# Altium schematic sheet 01 INPUT_PWR.SchDoc
size 420 x 297 mm; Address1: Address1; Address2: Address2; Address3: Address3; Address4: Address4; DocumentNumber: АБВГ.123456.001 Э3; SheetNumber: 1; SheetTotal: 23; Scale: 1:1; DocumentType: Схема электрическая принципиальная; FirstReferrence: АБВГ.123456.001
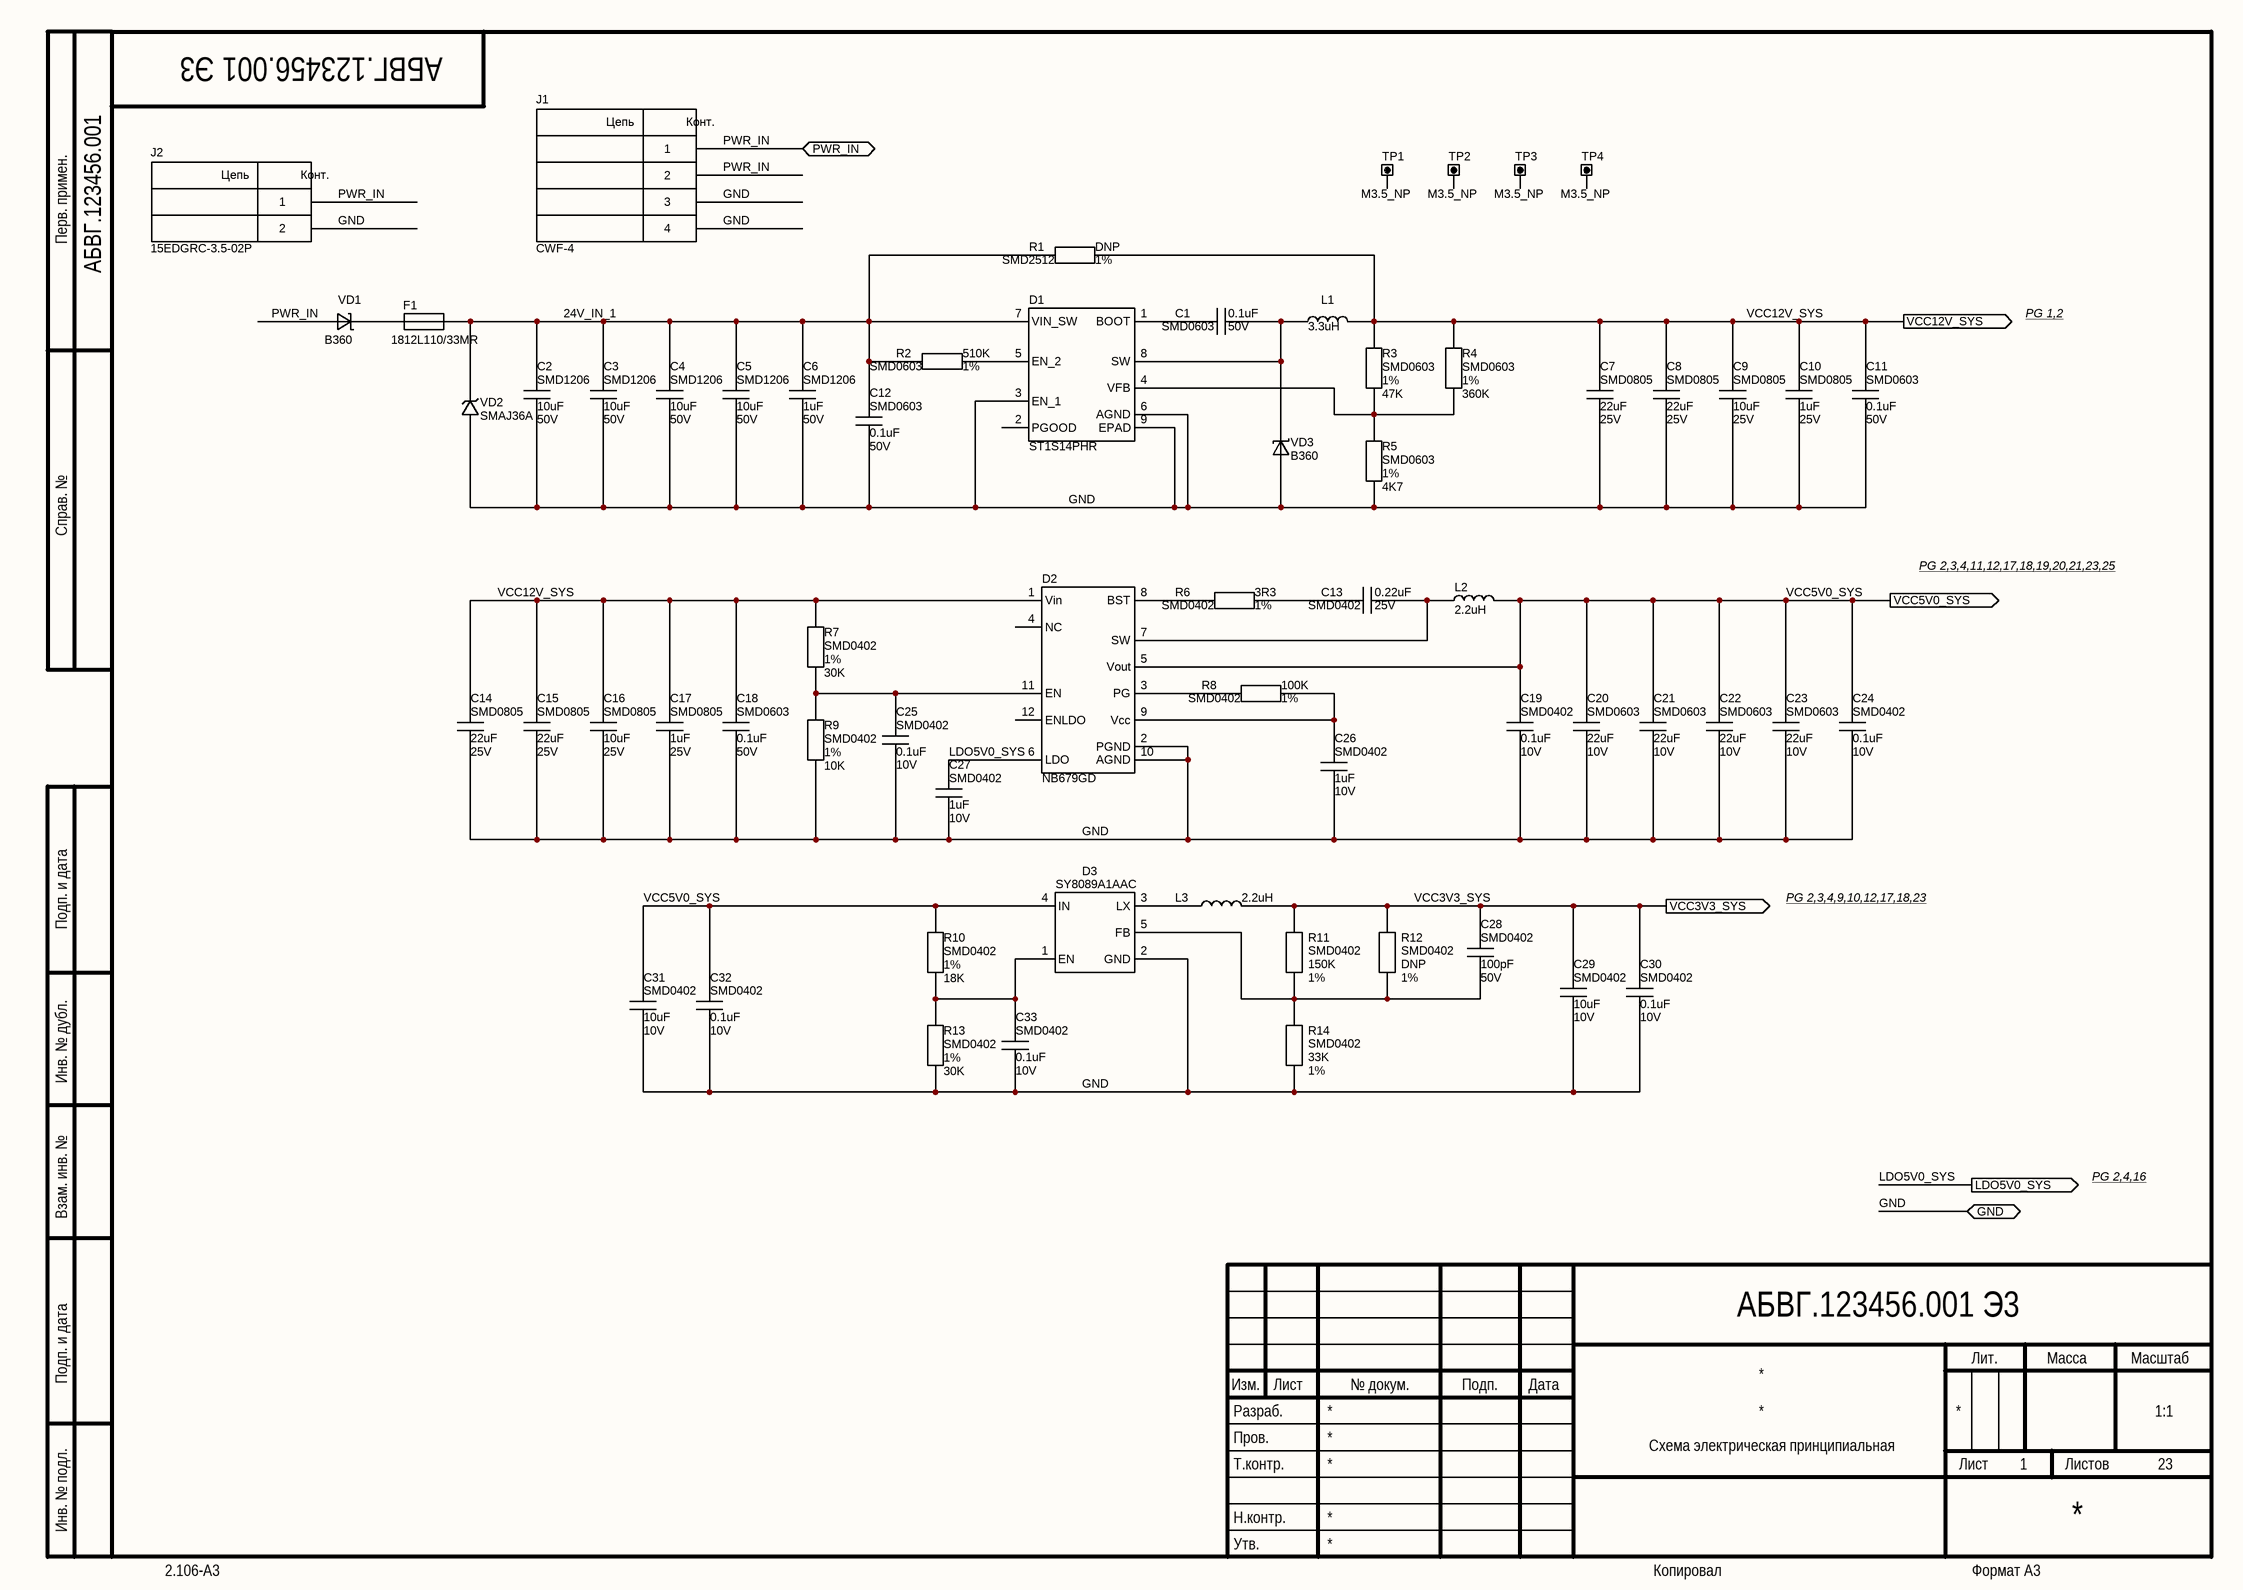
[diagram p0: 01 INPUT_PWR.SchDoc]

## Parts
C1  Package: SMD0603  Voltage: 50V  [CAP_SMD_0603]  (hidden comment: 0.1uF)
C2  Package: SMD1206  Voltage: 50V  [CAP_SMD_1206]  (hidden comment: 10uF)
C3  Package: SMD1206  Voltage: 50V  [CAP_SMD_1206]  (hidden comment: 10uF)
C4  Package: SMD1206  Voltage: 50V  [CAP_SMD_1206]  (hidden comment: 10uF)
C5  Package: SMD1206  Voltage: 50V  [CAP_SMD_1206]  (hidden comment: 10uF)
C6  Package: SMD1206  Voltage: 50V  [CAP_SMD_1206]  (hidden comment: 1uF)
C7  Package: SMD0805  Voltage: 25V  [CAP_SMD_0805]  (hidden comment: 22uF)
C8  Package: SMD0805  Voltage: 25V  [CAP_SMD_0805]  (hidden comment: 22uF)
C9  Package: SMD0805  Voltage: 25V  [CAP_SMD_0805]  (hidden comment: 10uF)
C10  Package: SMD0805  Voltage: 25V  [CAP_SMD_0805]  (hidden comment: 1uF)
C11  Package: SMD0603  Voltage: 50V  [CAP_SMD_0603]  (hidden comment: 0.1uF)
C12  Package: SMD0603  Voltage: 50V  [CAP_SMD_0603]  (hidden comment: 0.1uF)
C13  Package: SMD0402  Voltage: 25V  [CAP_SMD_0402]  (hidden comment: 0.22uF)
C14  Package: SMD0805  Voltage: 25V  [CAP_SMD_0805]  (hidden comment: 22uF)
C15  Package: SMD0805  Voltage: 25V  [CAP_SMD_0805]  (hidden comment: 22uF)
C16  Package: SMD0805  Voltage: 25V  [CAP_SMD_0805]  (hidden comment: 10uF)
C17  Package: SMD0805  Voltage: 25V  [CAP_SMD_0805]  (hidden comment: 1uF)
C18  Package: SMD0603  Voltage: 50V  [CAP_SMD_0603]  (hidden comment: 0.1uF)
C19  Package: SMD0402  Voltage: 10V  [CAP_SMD_0402]  (hidden comment: 0.1uF)
C20  Package: SMD0603  Voltage: 10V  [CAP_SMD_0603]  (hidden comment: 22uF)
C21  Package: SMD0603  Voltage: 10V  [CAP_SMD_0603]  (hidden comment: 22uF)
C22  Package: SMD0603  Voltage: 10V  [CAP_SMD_0603]  (hidden comment: 22uF)
C23  Package: SMD0603  Voltage: 10V  [CAP_SMD_0603]  (hidden comment: 22uF)
C24  Package: SMD0402  Voltage: 10V  [CAP_SMD_0402]  (hidden comment: 0.1uF)
C25  Package: SMD0402  Voltage: 10V  [CAP_SMD_0402]  (hidden comment: 0.1uF)
C26  Package: SMD0402  Voltage: 10V  [CAP_SMD_0402]  (hidden comment: 1uF)
C27  Package: SMD0402  Voltage: 10V  [CAP_SMD_0402]  (hidden comment: 1uF)
C28  Package: SMD0402  Voltage: 50V  [CAP_SMD_0402]  (hidden comment: 100pF)
C29  Package: SMD0402  Voltage: 10V  [CAP_SMD_0402]  (hidden comment: 10uF)
C30  Package: SMD0402  Voltage: 10V  [CAP_SMD_0402]  (hidden comment: 0.1uF)
C31  Package: SMD0402  Voltage: 10V  [CAP_SMD_0402]  (hidden comment: 10uF)
C32  Package: SMD0402  Voltage: 10V  [CAP_SMD_0402]  (hidden comment: 0.1uF)
C33  Package: SMD0402  Voltage: 10V  [CAP_SMD_0402]  (hidden comment: 0.1uF)
D1  ST1S14PHR  [SO8_PWR]
D2  NB679GD  [QFN-12_2mmx3mm]
D3  SY8089A1AAC  [SOT23-5]
F1  value 1812L110/33MR  [FUSE_SMD_1812]  (hidden comment: Value)
J1  CWF-4  [CWF-4]
J2  15EDGRC-3.5-02P  [15EDGRC-3.5-02P]
L1  value 3.3uH  [IHLP2020]  (hidden comment: Value)
L2  value 2.2uH  [IHLP2020]  (hidden comment: Value)
L3  value 2.2uH  [HEI252012A]  (hidden comment: Value)
R1  Package: SMD2512  Tolerance: 1%  [RES_SMD_2512]  (hidden comment: DNP)
R2  Package: SMD0603  Tolerance: 1%  [RES_SMD_0603]  (hidden comment: 510K)
R3  Package: SMD0603  Tolerance: 1%  [RES_SMD_0603]  (hidden comment: 47K)
R4  Package: SMD0603  Tolerance: 1%  [RES_SMD_0603]  (hidden comment: 360K)
R5  Package: SMD0603  Tolerance: 1%  [RES_SMD_0603]  (hidden comment: 4K7)
R6  Package: SMD0402  Tolerance: 1%  [RES_SMD_0402]  (hidden comment: 3R3)
R7  Package: SMD0402  Tolerance: 1%  [RES_SMD_0402]  (hidden comment: 30K)
R8  Package: SMD0402  Tolerance: 1%  [RES_SMD_0402]  (hidden comment: 100K)
R9  Package: SMD0402  Tolerance: 1%  [RES_SMD_0402]  (hidden comment: 10K)
R10  Package: SMD0402  Tolerance: 1%  [RES_SMD_0402]  (hidden comment: 18K)
R11  Package: SMD0402  Tolerance: 1%  [RES_SMD_0402]  (hidden comment: 150K)
R12  Package: SMD0402  Tolerance: 1%  [RES_SMD_0402]  (hidden comment: DNP)
R13  Package: SMD0402  Tolerance: 1%  [RES_SMD_0402]  (hidden comment: 30K)
R14  Package: SMD0402  Tolerance: 1%  [RES_SMD_0402]  (hidden comment: 33K)
TP1  M3.5_NP  [M3.5_NP]
TP2  M3.5_NP  [M3.5_NP]
TP3  M3.5_NP  [M3.5_NP]
TP4  M3.5_NP  [M3.5_NP]
VD1  value B360  [SMA]  (hidden comment: Value)
VD2  SMAJ36A  [SMA]
VD3  value B360  [SMA]  (hidden comment: Value)

## Ports
GND (bidir), LDO5V0_SYS (out), PWR_IN (bidir), VCC3V3_SYS (out), VCC5V0_SYS (out), VCC12V_SYS (out)

## Nets
24V_IN_1: C2.2 C3.2 C4.2 C5.2 C6.2 C12.2 D1.7(VIN_SW) F1.2 R1.1 R2.1 VD2.2(C)
GND: C2.1 C3.1 C4.1 C5.1 C6.1 C7.1 C8.1 C9.1 C10.1 C11.1 C12.1 C14.1 C15.1 C16.1 C17.1 C18.1 C19.2 C20.1 C21.1 C22.1 C23.1 C24.2 C25.2 C26.2 C27.2 C29.2 C30.2 C31.2 C32.2 C33.2 D1.3(EN_1) D1.6(AGND) D1.9(EPAD) D2.2(PGND) D2.10(AGND) D3.2(GND) J1.3 J1.4 J2.2 R5.1 R9.1 R13.1 R14.1 VD2.1(A) VD3.1(A) ; port GND
LDO5V0_SYS: C27.1 D2.6(LDO) ; port LDO5V0_SYS
PWR_IN: J1.1 J1.2 J2.1 VD1.1(A) ; port PWR_IN
VCC3V3_SYS: C28.1 C29.1 C30.1 L3.1 R11.2 R12.2 ; port VCC3V3_SYS
VCC5V0_SYS: C19.1 C20.2 C21.2 C22.2 C23.2 C24.1 C31.1 C32.1 D2.5(Vout) D3.4(IN) L2.1 R10.2 ; port VCC5V0_SYS
VCC12V_SYS: C7.2 C8.2 C9.2 C10.2 C11.2 C14.2 C15.2 C16.2 C17.2 C18.2 D2.1(Vin) L1.1 R1.2 R3.2 R4.2 R7.2 ; port VCC12V_SYS
NetC1_1: C1.1 D1.8(SW) L1.2 VD3.2(C)
NetC1_2: C1.2 D1.1(BOOT)
NetC13_1: C13.1 D2.7(SW) L2.2
NetC13_2: C13.2 R6.2
NetC25_1: C25.1 D2.11(EN) R7.1 R9.2
NetC26_1: C26.1 D2.9(Vcc) R8.1
NetC28_2: C28.2 D3.5(FB) R11.1 R12.1 R14.2
NetC33_1: C33.1 D3.1(EN) R10.1 R13.2
NetD1_4: D1.4(VFB) R3.1 R4.1 R5.2
NetD1_5: D1.5(EN_2) R2.2
NetD2_3: D2.3(PG) R8.2
NetD2_8: D2.8(BST) R6.1
NetD3_3: D3.3(LX) L3.2
NetF1_1: F1.1 VD1.2(C)

Not connected (* = marked no-connect by the designer): D1 2(PGOOD); D2 4(NC) 12(ENLDO); TP1 1; TP2 1; TP3 1; TP4 1

## Notes on the sheet
- Перв. примен.
- PG 1,2
- Справ. №
- PG 2,3,4,11,12,17,18,19,20,21,23,25
- Подп. и дата
- PG 2,3,4,9,10,12,17,18,23
- Инв. № дубл.
- PG 2,4,16
- Взам. инв. №
- Разраб.
- Изм.
- Лист
- № докум.
- Подп.
- Дата
- Лит.
- Масса
- Масштаб
- Пров.
- Т.контр.
- Листов
- Инв. № подл.
- Утв.
- Н.контр.
- 2.106-A3
- Копировал
- Формат А3
- (in symbol CON2) Цепь; Конт.
- (in symbol CON4) Цепь; Конт.

## Library data of the parts
C1 C11 C12 C18 = Ceramic_Cap: PartNumber: CC0603KRX7R9BB104; ComponentType: SMD Ceramic Chip Capacitor; Manufacter: *; Tolerance: *; ClassName: *; Value: 0.1uF
C2-C5 = Ceramic_Cap: PartNumber: CL31B106KBHNNNE; ComponentType: SMD Ceramic Chip Capacitor; Manufacter: *; Tolerance: *; ClassName: *; Value: 10uF
C6 = Ceramic_Cap: PartNumber: CC1206MRY5V9BB105; ComponentType: SMD Ceramic Chip Capacitor; Manufacter: *; Tolerance: *; ClassName: *; Value: 1uF
C7 C8 C14 C15 = Ceramic_Cap: PartNumber: CC0805MKX5R8BB226; ComponentType: SMD Ceramic Chip Capacitor; Manufacter: *; Tolerance: *; ClassName: *; Value: 22uF
C9 C16 = Ceramic_Cap: PartNumber: CL21A106KAYNNNE; ComponentType: SMD Ceramic Chip Capacitor; Manufacter: *; Tolerance: *; ClassName: *; Value: 10uF
C10 C17 = Ceramic_Cap: PartNumber: CC0805KKX7R8BB105; ComponentType: SMD Ceramic Chip Capacitor; Manufacter: *; Tolerance: *; ClassName: *; Value: 1uF
C13 = Ceramic_Cap: PartNumber: CC0402KRX5R8BB224; ComponentType: SMD Ceramic Chip Capacitor; Manufacter: *; Tolerance: *; ClassName: *; Value: 0.22uF
C19 C24 C25 C30 C32 C33 = Ceramic_Cap: PartNumber: CC0402KRX5R6BB104; ComponentType: SMD Ceramic Chip Capacitor; Manufacter: *; Tolerance: *; ClassName: *; Value: 0.1uF
C20-C23 = Ceramic_Cap: PartNumber: CL10A226MP8NUNE; ComponentType: SMD Ceramic Chip Capacitor; Manufacter: *; Tolerance: *; ClassName: *; Value: 22uF
C26 C27 = Ceramic_Cap: PartNumber: CC0402KRX5R6BB105; ComponentType: SMD Ceramic Chip Capacitor; Manufacter: *; Tolerance: *; ClassName: *; Value: 1uF
C28 = Ceramic_Cap: PartNumber: CC0402KRNPO9BN101; ComponentType: SMD Ceramic Chip Capacitor; Manufacter: *; Tolerance: *; ClassName: *; Value: 100pF
C29 C31 = Ceramic_Cap: PartNumber: CC0402MRX5R6BB106; ComponentType: SMD Ceramic Chip Capacitor; Manufacter: *; Tolerance: *; ClassName: *; Value: 10uF
D1 = ST1S14: Manufacter: ST; ComponentType: step-down switching regulator; Package: Power SO8; PartNumber: ST1S14PHR; ClassName: *; Value: ST1S14PHR
D3 = SY8088AAC: ComponentType: SMD Chip Resistor; Manufacter: *; Voltage: *; ClassName: *; Tolerance: *; PartNumber: SY8089A1AAC; Package: SOT23-5; Value: SY8089A1AAC
F1 = Fuse: ComponentType: *; Manufacter: *; Package: SMD1812; PartNumber: 1812L110/33MR; ClassName: *
J1 = CON4: PartNumber: DS1069-4MVW6X (CWF-4); Manufacter: *; Package: CWF-4; ClassName: *; Value: CWF-4
J2 = CON2: ComponentType: *; Manufacter: *; Package: 15EDGRC-3.5-02P; PartNumber: 15EDGRC-3.5-02P; ClassName: *; Value: 15EDGRC-3.5-02P
L1 = Inductor_smal: PartNumber: IHLP2020CZER3R3M01; ComponentType: *; Manufacter: *; Package: IHLP2020; ClassName: *
L2 = Inductor_smal: PartNumber: IHLP2020CZER2R2M01; ComponentType: *; Manufacter: *; Package: IHLP2020; ClassName: *
L3 = Inductor_smal: PartNumber: HEI252012A-2R2M-Q8; ComponentType: *; Manufacter: *; Package: HEI252012A; ClassName: *
R1 = Chip_Res: PartNumber: RC2512FK-070RL; ComponentType: SMD Chip Resistor; Manufacter: *; Voltage: *; ClassName: *; Value: DNP
R2 = Chip_Res: PartNumber: RC0603FR-07510KL; ComponentType: SMD Chip Resistor; Manufacter: *; Voltage: *; ClassName: *; Value: 510K
R3 = Chip_Res: PartNumber: RC0603FR-0747KL; ComponentType: SMD Chip Resistor; Manufacter: *; Voltage: *; ClassName: *; Value: 47K
R4 = Chip_Res: PartNumber: RC0603FR-07360KL; ComponentType: SMD Chip Resistor; Manufacter: *; Voltage: *; ClassName: *; Value: 360K
R5 = Chip_Res: PartNumber: RC0603FR-074K7L; ComponentType: SMD Chip Resistor; Manufacter: *; Voltage: *; ClassName: *; Value: 4K7
R6 = Chip_Res: PartNumber: RC0402FR-073R3L; ComponentType: SMD Chip Resistor; Manufacter: *; Voltage: *; ClassName: *; Value: 3R3
R7 R13 = Chip_Res: PartNumber: RC0402FR-0730KL; ComponentType: SMD Chip Resistor; Manufacter: *; Voltage: *; ClassName: *; Value: 30K
R8 = Chip_Res: PartNumber: RC0402FR-07100KL; ComponentType: SMD Chip Resistor; Manufacter: *; Voltage: *; ClassName: *; Value: 100K
R9 = Chip_Res: PartNumber: RC0402FR-0710KL; ComponentType: SMD Chip Resistor; Manufacter: *; Voltage: *; ClassName: *; Value: 10K
R10 = Chip_Res: PartNumber: RC0402FR-0718KL; ComponentType: SMD Chip Resistor; Manufacter: *; Voltage: *; ClassName: *; Value: 18K
R11 = Chip_Res: PartNumber: RC0402FR-07150KL; ComponentType: SMD Chip Resistor; Manufacter: *; Voltage: *; ClassName: *; Value: 150K
R12 = Chip_Res: PartNumber: Do Not Place; ComponentType: SMD Chip Resistor; Manufacter: *; Voltage: *; ClassName: *; Value: DNP
R14 = Chip_Res: PartNumber: RC0402FR-0733KL; ComponentType: SMD Chip Resistor; Manufacter: *; Voltage: *; ClassName: *; Value: 33K
TP1-TP4 = TP: ComponentType: *; Manufacter: *; Package: *; PartNumber: *; ClassName: *; Value: M3.5_NP
VD1 VD3 = ShottkyDiode: ComponentType: *; Manufacter: *; Package: SMA; PartNumber: B360; ClassName: *
VD2 = ZenerDiode: ComponentType: *; Manufacter: *; Package: SMA; PartNumber: SMAJ36A; ClassName: *; Value: SMAJ36A
D2 = NB679GD: ComponentType: SMD Chip Resistor; Manufacter: *; Voltage: *; ClassName: *; Tolerance: *; PartNumber: NB679GD; Package: QFN-12; Value: NB679GD